# EAGLE design USB_Interlock (EAGLE 7.1.0)
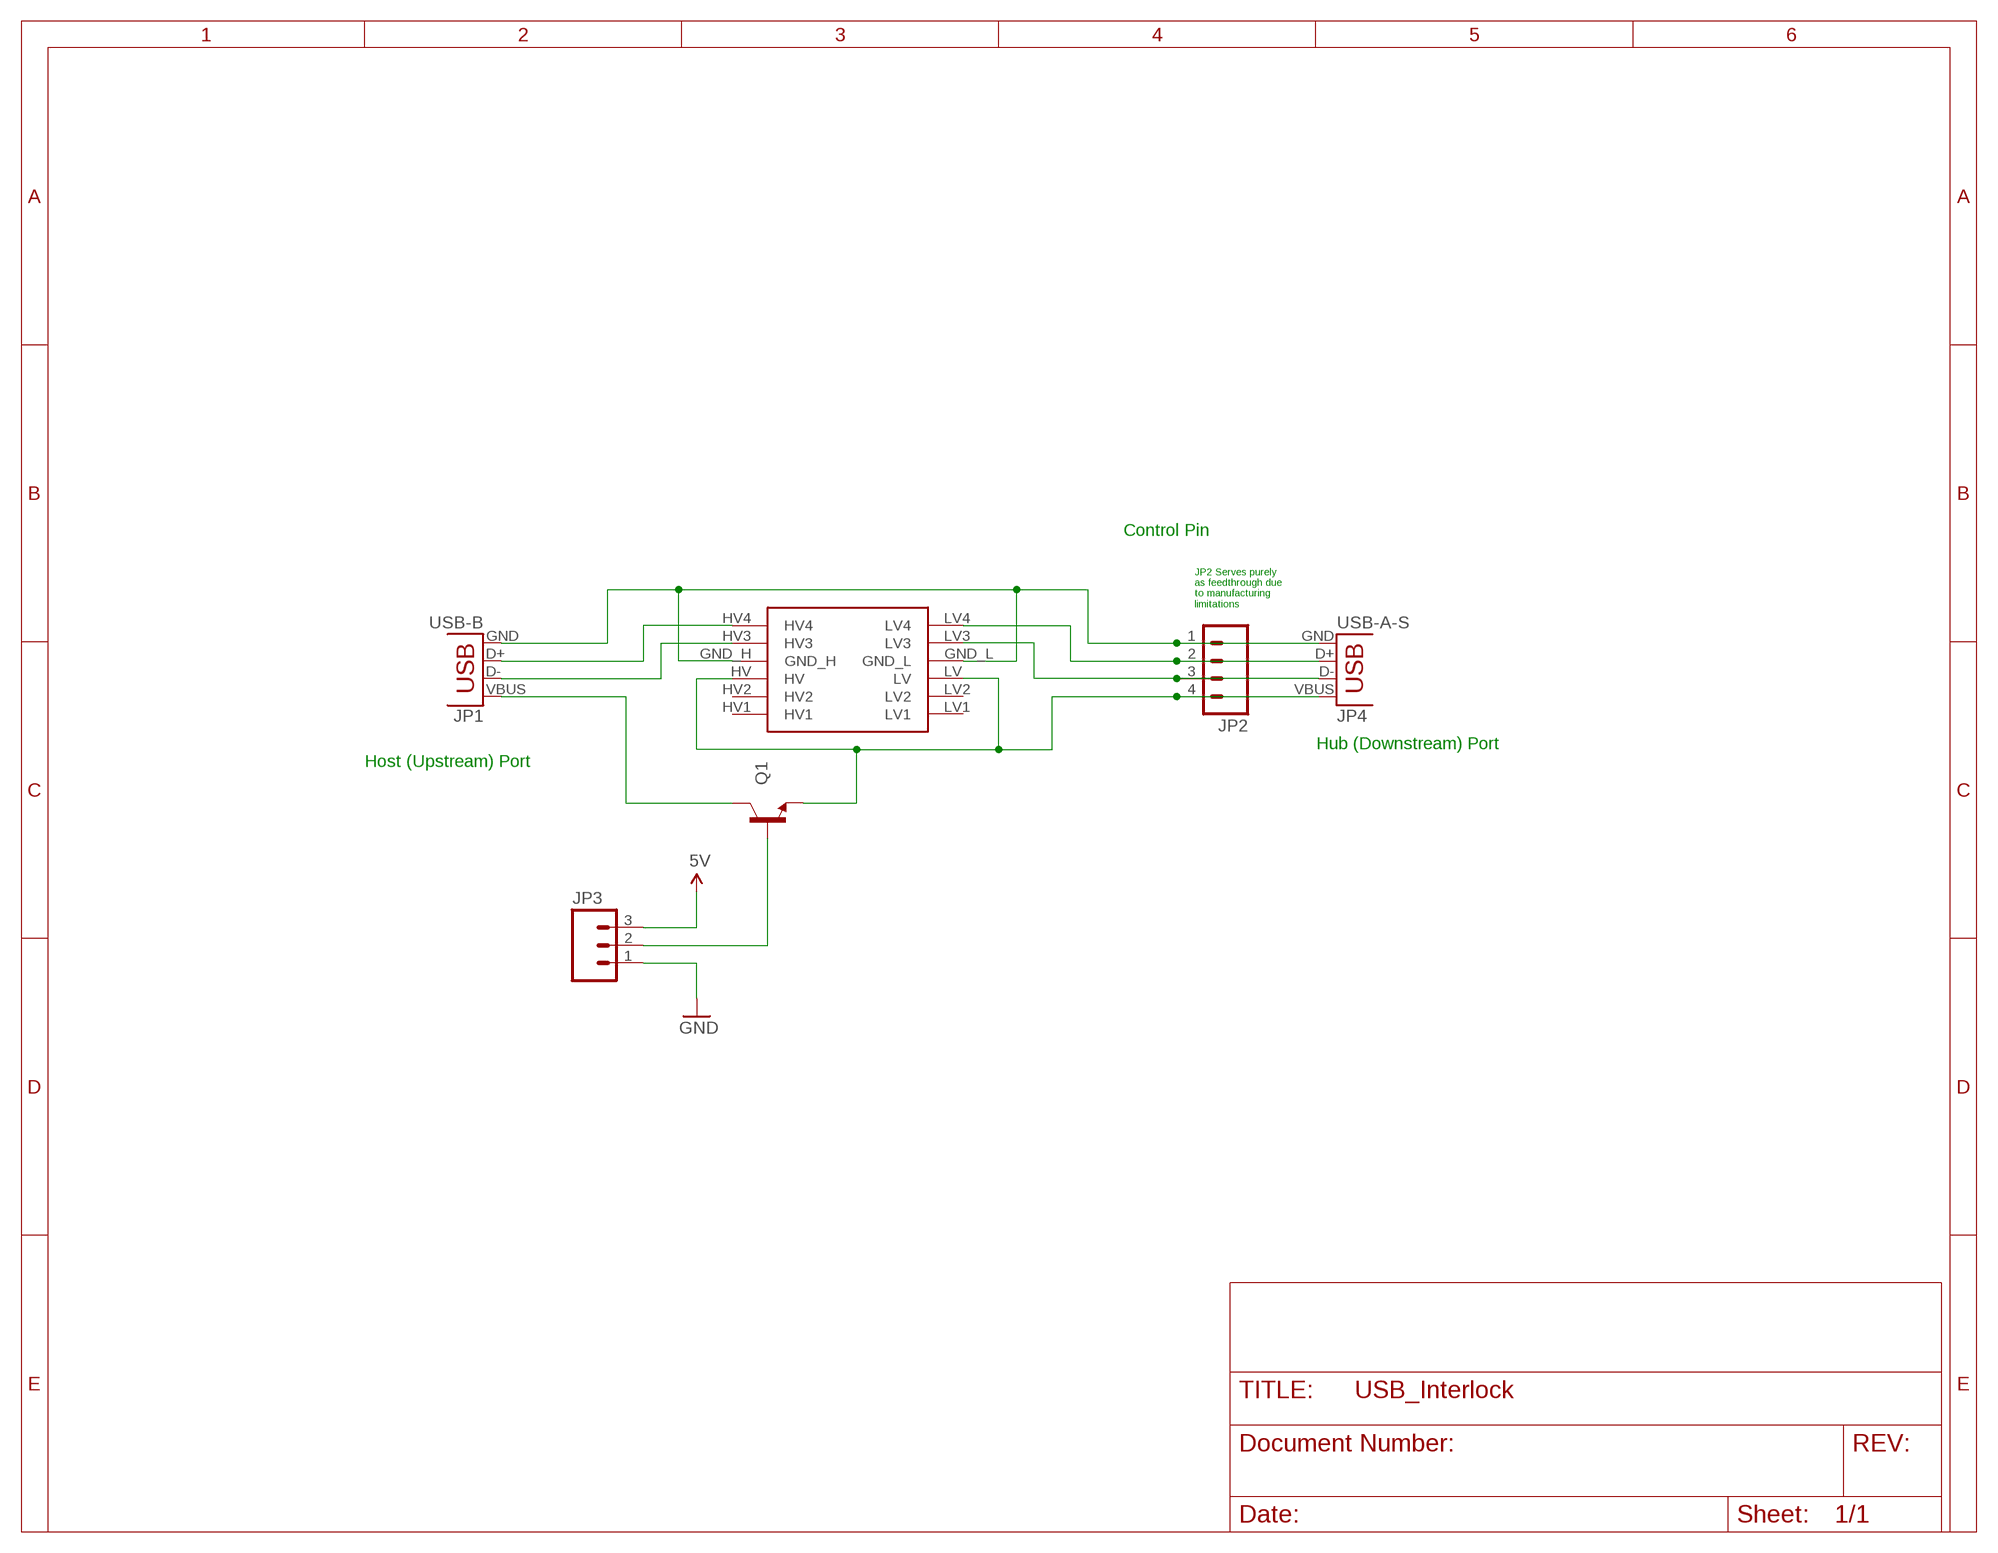
[diagram p0: schematic, sheet 1]

## Parts
JP1  USB-B  USBPTH  [USB-B-PTH]
JP2  M04LONGPADS  [1X04_LONGPADS]
JP3  M03LONGPADS  [1X03_LONGPADS]
JP4  USB-A-S  [USB-A-S]
Q1  TRANSISTOR_NPNBC547  [TO-92-AMMO]
U$1  LOGIC_LEVEL_CONVERTER  [LOGIC_LEVEL_CONVERTER]

## Nets
5V: JP3.3
CTRL: JP3.2 Q1.2(B)
GND: JP1.GND JP2.1 JP3.1 JP4.GND U$1.GND_H U$1.GND_L
N$1: JP2.4 JP4.VBUS Q1.3(E) U$1.HV U$1.LV
N$2: JP2.2 JP4.D+ U$1.LV4
N$3: JP2.3 JP4.D- U$1.LV3
N$7: JP1.D+ U$1.HV4
N$8: JP1.D- U$1.HV3
N$9: JP1.VBUS Q1.1(C)
Unconnected: U$1.HV1 U$1.HV2 U$1.LV1 U$1.LV2

## Notes on the sheet
- Control Pin
- JP2 Serves purely 
  as feedthrough due
  to manufacturing
  limitations
- Hub (Downstream) Port
- Host (Upstream) Port

## Library data of the parts
JP1 = SparkFun-Connectors:USB: USB Connectors USB-B-PTH is fully proven SKU : PRT-00139/CONN-08278 USB-miniB is fully proven SKU : PRT-00587 USB-A-PCB is untested. USB-A-H is throughly reviewed, but untested. Spark Fun Electronics SKU : PRT-00437 USB-B-SMT is throughly reviewed, but untested. Needs silkscreen touching up. USB-A-S has not been used/tested USB-MB-H has not been used/tested USB-MICROB has been used. CONN-09505; PROD_ID: CONN-08278
JP2 = SparkFun-Connectors:M04: Header 4 Standard 4-pin 0.1" header. Use with straight break away headers (SKU : PRT-00116), right angle break away headers (PRT-00553), swiss pins (PRT-00743), machine pins (PRT-00117), and female headers (PRT-00115). Molex polarized connector foot print use with SKU : PRT-08231 with associated crimp pins and housings. 1MM SMD Version SKU: PRT-10208
JP3 = SparkFun-Connectors:M03: Header 3 Standard 3-pin 0.1" header. Use with straight break away headers (SKU : PRT-00116), right angle break away headers (PRT-00553), swiss pins (PRT-00743), machine pins (PRT-00117), and female headers (PRT-00115). Molex polarized connector foot print use with SKU : PRT-08232 with associated crimp pins and housings.
JP4 = SparkFun-Connectors:USB: USB Connectors USB-B-PTH is fully proven SKU : PRT-00139/CONN-08278 USB-miniB is fully proven SKU : PRT-00587 USB-A-PCB is untested. USB-A-H is throughly reviewed, but untested. Spark Fun Electronics SKU : PRT-00437 USB-B-SMT is throughly reviewed, but untested. Needs silkscreen touching up. USB-A-S has not been used/tested USB-MB-H has not been used/tested USB-MICROB has been used. CONN-09505
Q1 = SparkFun-DiscreteSemi:TRANSISTOR_NPN: Generic NPN BJT MMBT2222A - TRANS-08049 (SOT-23, 1A 40V) MPSA42 - TRANS-09116 (SOT-23, 500mA 300V) MMBT5088LT1G - TRANS-11160 (SOT-23, 50 mA 30V) BC547 - COM-08928 <http://www.sparkfun.com/products/8928> (TO-92 45V 100mA) (1.Collector 2.Base 3.Emitter) 2N3904 - COM-00521 <http://www.sparkfun.com/products/521> (TO-92 40V 200mA) (1.Emitter 2.Base 3.Collector) P2N2222A - COM-12852 <http://www.sparkfun.com/products/12852> (TO-92 40V 600mA) (1.Collector 2.Base 3.Emitter)
U$1 = SparkFun-Boards:LOGIC_LEVEL_CONVERTER: Logic Level Converter (3.3v - 5v) https://www.sparkfun.com/products/8745

## Board
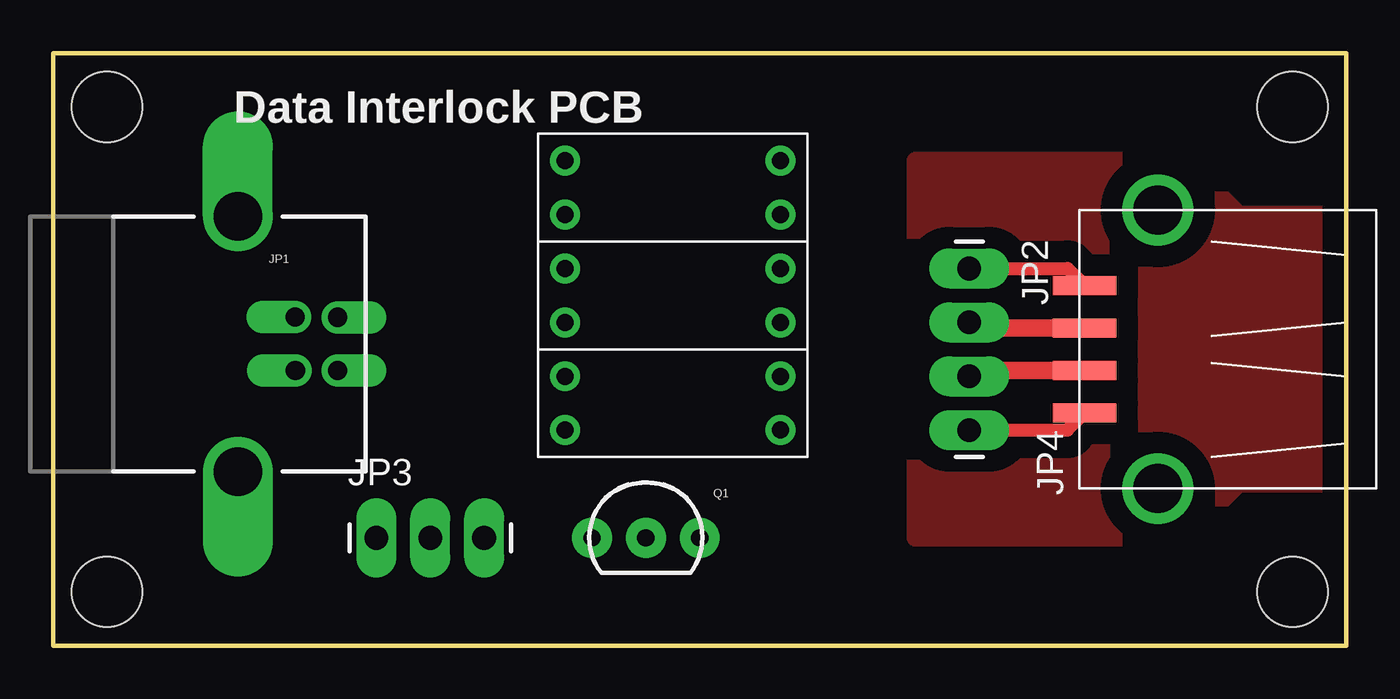
[diagram p1: board, top side]
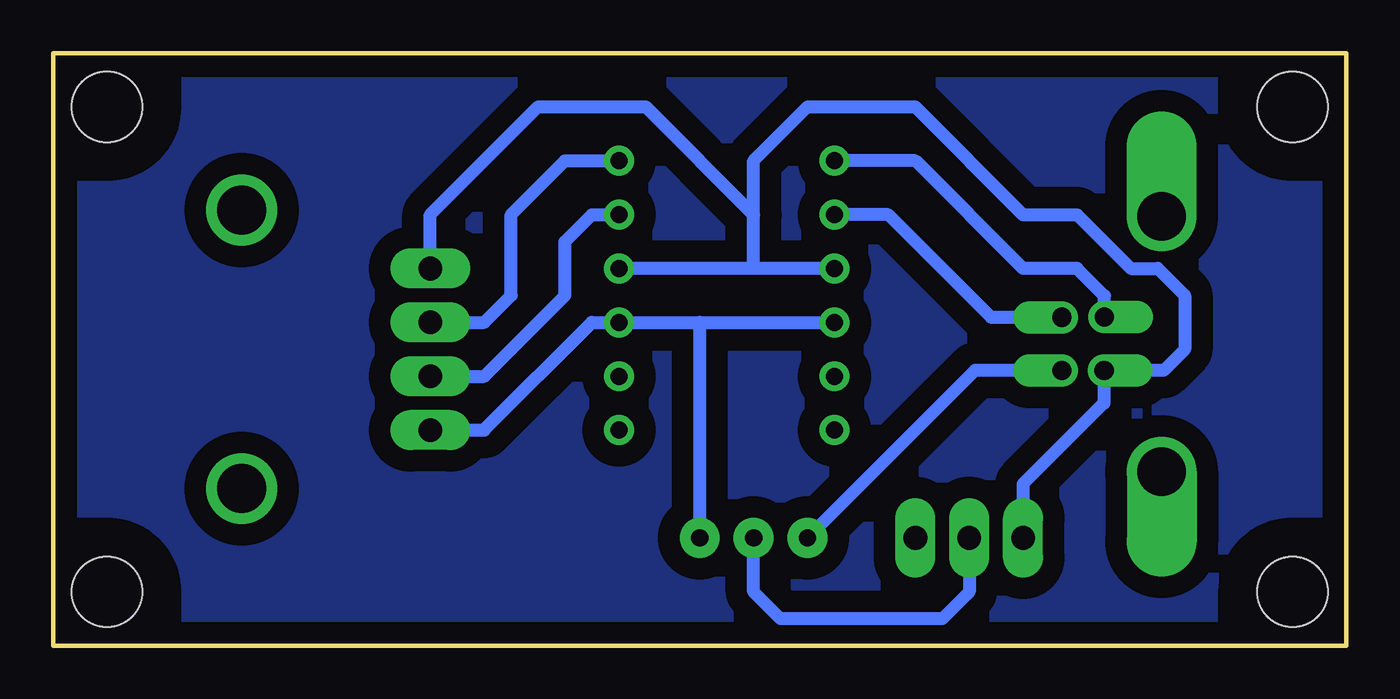
[diagram p2: board, bottom side, seen from below]

Size 60.96 x 27.94 mm. Coordinates in mm from the lower left corner, seen from the top.
Outline: 0,0 60.96,0 60.96,27.94 0,27.94 0,0
Copper layers (1*16): Top 0.035mm / dielectric 1.5mm / Bottom 0.035mm
Design rules "SparkFun *": minimum track width 24mil, minimum drill 20mil, track to track 18mil, track to pad 18mil, pad to pad 18mil, via to via 18mil, smd to smd 18mil, copper to edge 8mil, drill to drill 8mil, minimum pad ring 12mil, minimum via ring 10mil, stop-mask expansion 4mil, vias tented up to drill 20mil, thermal gap 16mil

### Footprints (pad centres in the part's own frame; a part is rotated, then mirrored left to right if it is on the bottom)
USB-B-PTH = drill 0.914 pad 1.422 offset: D+ -0.02,1.27; D- 1.981,1.25; GND 0,-1.25; VBUS 1.981,-1.25 | drill 2.286 offset: S1 -2.718,-6.02; S2 -2.718,6.02
1X04_LONGPADS = drill 1.118 pad 1.88 long: 1 0,0; 2 2.54,0; 3 5.08,0; 4 7.62,0
1X03_LONGPADS = drill 1.118 pad 1.88 long: 1 0,0; 2 2.54,0; 3 5.08,0
USB-A-S = smd 3 x 0.9: D+ 3.45,-1; D- 3.45,1; GND 3.45,-3; VBUS 3.45,3 | drill 2.311: P$5 0,-6.566; P$6 0,6.566
TO-92-AMMO = drill 0.813 pad 1.88: 1 -2.54,0; 2 0,0; 3 2.54,0
LOGIC_LEVEL_CONVERTER = drill 0.8: GND_H 11.43,6.35; GND_L 1.27,6.35; HV 11.43,8.89; HV1 11.43,13.97; HV2 11.43,11.43; HV3 11.43,3.81; HV4 11.43,1.27; LV 1.27,8.89; LV1 1.27,13.97; LV2 1.27,11.43; LV3 1.27,3.81; LV4 1.27,1.27
STAND-OFF = hole 3.302: 0,0

### Placement (x,y rotation side)
JP1  11.43,14.22 0 top
JP2  43.18,17.78 270 top
JP3  15.24,5.08 0 top
JP4  52.07,13.97 180 top
Q1  27.94,5.08 0 top
U$1  35.56,24.13 180 top
U$2  [STAND-OFF]  2.54,2.54 0 top
U$3  [STAND-OFF]  2.54,25.4 0 top
U$4  [STAND-OFF]  58.42,25.4 0 top
U$5  [STAND-OFF]  58.42,2.54 0 top

### Tracks (layer width: path | path; a pad name or v marks a point on that pad's centre or on a via)
CTRL
  Bottom 0.61: JP3.2 17.78,2.54 19.05,1.27 26.67,1.27 27.94,2.54 Q1.2
GND
  Top 0.61: JP2.1 47.81,17.78 JP4.GND
  Bottom 0.61: JP3.1 15.24,7.62 11.43,11.43 JP1.GND 8.62,12.97 7.62,13.97 7.62,16.51 8.89,17.78 10.16,17.78 12.7,20.32 15.24,20.32 20.32,25.4 25.4,25.4 27.94,22.86 27.94,20.32 | JP2.1 43.18,20.32 38.1,25.4 33.02,25.4 27.94,20.32 | 27.94,17.78 U$1.GND_L | U$1.GND_H 27.94,17.78 | 27.94,17.78 27.94,20.32
GND_PLN
  pour Bottom (isolate 1.016, no thermals): 0,21.59 2.54,21.59 arc90 6.35,25.4 6.35,27.94 54.61,27.94 54.61,25.4 arc90 58.42,21.59 60.96,21.59 60.96,6.35 58.42,6.35 arc90 54.61,2.54 54.61,0 6.35,0 6.35,2.54 arc90 2.54,6.35 0,6.35
N$1
  Top 0.61: JP2.4 47.81,10.16 JP4.VBUS
  Bottom 0.61: Q1.3 30.48,15.24 | 30.48,15.24 U$1.HV | JP2.4 40.64,10.16 35.56,15.24 U$1.LV 30.48,15.24
N$2
  Top 0.813: JP4.D+ 43.45,14.97 JP2.2
  Bottom 0.61: JP2.2 40.64,15.24 39.37,16.51 39.37,20.32 36.83,22.86 U$1.LV4
N$3
  Top 0.813: JP4.D- 43.45,12.97 JP2.3
  Bottom 0.61: JP2.3 40.64,12.7 36.83,16.51 36.83,19.05 35.56,20.32 U$1.LV3
N$7
  Bottom 0.61: JP1.D+ 11.41,16.49 12.7,17.78 15.24,17.78 20.32,22.86 U$1.HV4
N$8
  Bottom 0.61: JP1.D- 16.74,15.47 21.59,20.32 U$1.HV3
N$9
  Bottom 0.61: JP1.VBUS 17.51,12.97 Q1.1
N$10
  pour Top (isolate 1.016): 40.64,22.86 53.34,22.86 55.88,20.32 60.96,20.32 60.96,7.62 55.88,7.62 53.34,5.08 40.64,5.08

### Text on the board
tPlace: Data Interlock PCB